# Altium schematic sheet DC-DC Converters.SchDoc: DC-DC Converters
size B; Organization: Drexel University; Address1: ECE Senior Design; Address2: 2018-2019; Address3: ECE-08; Revision: 1.0; SheetNumber: 7; SheetTotal: 9
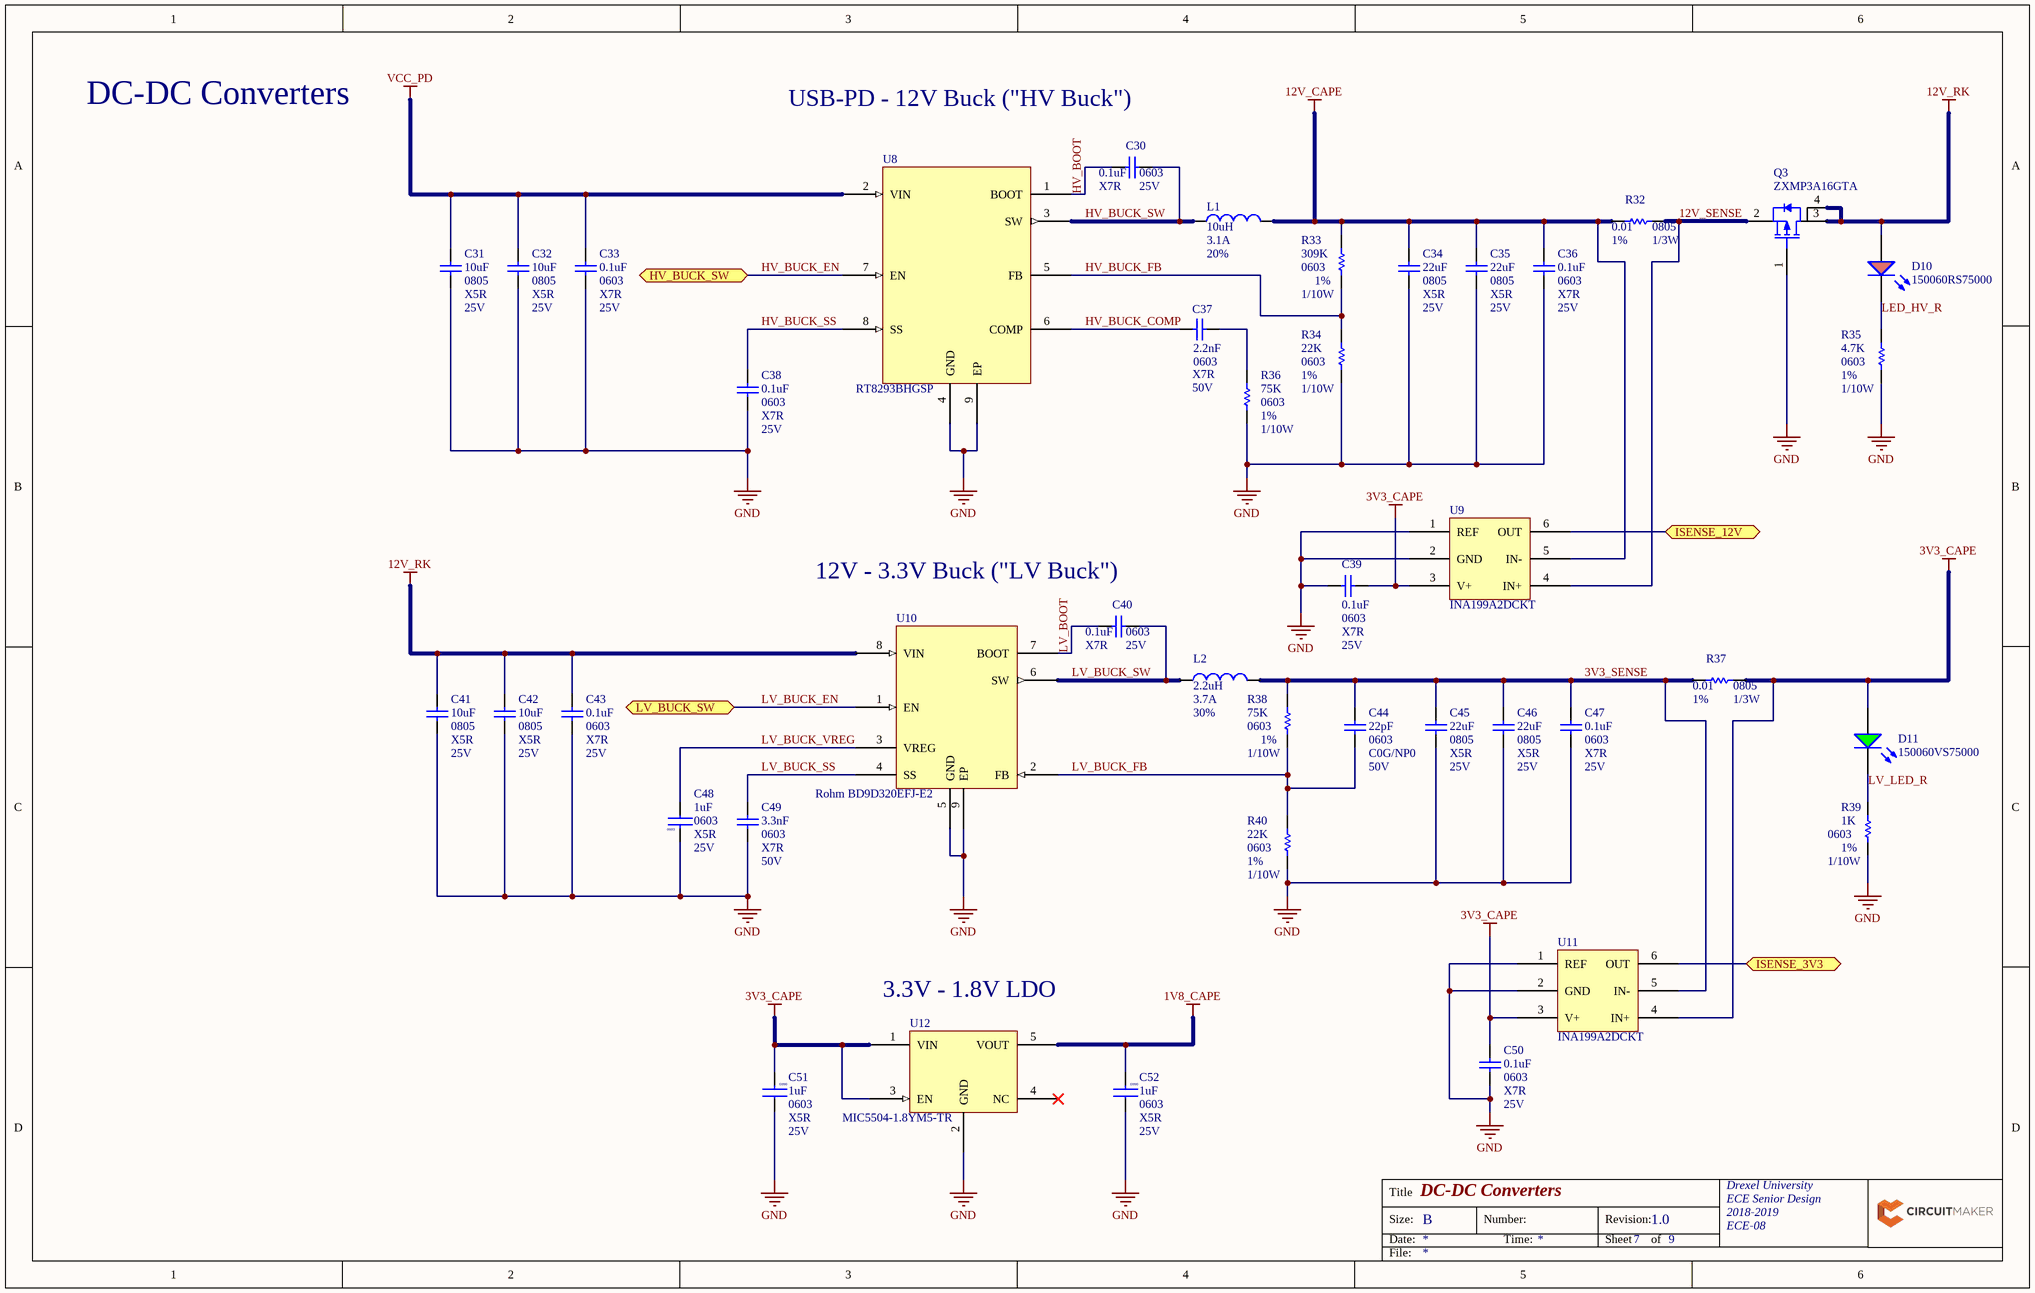
[diagram p0: DC-DC Converters.SchDoc]

## Parts
C30  Dielectric Characteristic: X7R  Voltage Rating (DC): 25V  Capacitance: 0.1uF  Package: 0603  [PCB-8usp83j76ntw2xroyu3n-1]  (hidden comment: Würth Elektronik 885012206071)
C31  Voltage Rating (DC): 25V  Package: 0805  Capacitance: 10uF  Temperature Coefficient: X5R  [Capacitor_0805]  (hidden comment: Murata GRM21BR61E106MA73L)
C32  Voltage Rating (DC): 25V  Package: 0805  Capacitance: 10uF  Temperature Coefficient: X5R  [Capacitor_0805]  (hidden comment: Murata GRM21BR61E106MA73L)
C33  Dielectric Characteristic: X7R  Voltage Rating (DC): 25V  Capacitance: 0.1uF  Package: 0603  [PCB-8usp83j76ntw2xroyu3n-1]  (hidden comment: Würth Elektronik 885012206071)
C34  Case/Package: 0805  Capacitance: 22uF  Temperature Coefficient: X5R  Voltage Rating: 25V  [PCB-sm9io2v4t6ucfy8bcald-1]  (hidden comment: CL21A226MAQNNNE)
C35  Case/Package: 0805  Capacitance: 22uF  Temperature Coefficient: X5R  Voltage Rating: 25V  [PCB-sm9io2v4t6ucfy8bcald-1]  (hidden comment: CL21A226MAQNNNE)
C36  Dielectric Characteristic: X7R  Voltage Rating (DC): 25V  Capacitance: 0.1uF  Package: 0603  [PCB-8usp83j76ntw2xroyu3n-1]  (hidden comment: Würth Elektronik 885012206071)
C37  Capacitance: 2.2nF  Pacakge: 0603  Temperature Coefficient: X7R  Voltage Rating: 50V  [PCB-rt9y6alohkqhfgbzbx9m-1]  (hidden comment: Cap)
C38  Dielectric Characteristic: X7R  Voltage Rating (DC): 25V  Capacitance: 0.1uF  Package: 0603  [PCB-8usp83j76ntw2xroyu3n-1]  (hidden comment: Würth Elektronik 885012206071)
C39  Dielectric Characteristic: X7R  Voltage Rating (DC): 25V  Capacitance: 0.1uF  Package: 0603  [PCB-8usp83j76ntw2xroyu3n-1]  (hidden comment: Würth Elektronik 885012206071)
C40  Dielectric Characteristic: X7R  Voltage Rating (DC): 25V  Capacitance: 0.1uF  Package: 0603  [PCB-8usp83j76ntw2xroyu3n-1]  (hidden comment: Würth Elektronik 885012206071)
C41  Voltage Rating (DC): 25V  Package: 0805  Capacitance: 10uF  Temperature Coefficient: X5R  [Capacitor_0805]  (hidden comment: Murata GRM21BR61E106MA73L)
C42  Voltage Rating (DC): 25V  Package: 0805  Capacitance: 10uF  Temperature Coefficient: X5R  [Capacitor_0805]  (hidden comment: Murata GRM21BR61E106MA73L)
C43  Dielectric Characteristic: X7R  Voltage Rating (DC): 25V  Capacitance: 0.1uF  Package: 0603  [PCB-8usp83j76ntw2xroyu3n-1]  (hidden comment: Würth Elektronik 885012206071)
C44  Capacitance: 22pF  Voltage Rating: 50V  Temperature Coefficient: C0G/NP0  Package: 0603  [PCB-c1bc5fz63nm5dhuj9x7i-1]  (hidden comment: Samsung CL10C220JB8NFNC)
C45  Case/Package: 0805  Capacitance: 22uF  Temperature Coefficient: X5R  Voltage Rating: 25V  [PCB-sm9io2v4t6ucfy8bcald-1]  (hidden comment: CL21A226MAQNNNE)
C46  Case/Package: 0805  Capacitance: 22uF  Temperature Coefficient: X5R  Voltage Rating: 25V  [PCB-sm9io2v4t6ucfy8bcald-1]  (hidden comment: CL21A226MAQNNNE)
C47  Dielectric Characteristic: X7R  Voltage Rating (DC): 25V  Capacitance: 0.1uF  Package: 0603  [PCB-8usp83j76ntw2xroyu3n-1]  (hidden comment: Würth Elektronik 885012206071)
C48  Case/Package: 0603  Dielectric Characteristic: X5R  Capacitance: 1uF  Voltage Rating (DC): 25V  [PCB-bncvufzharetcg4gy1u6-1]  (hidden comment: Taiyo Yuden TMK107BJ105KA-T)
C49  Capacitance: 3.3nF  Case/Package: 0603  Dielectric Characteristic: X7R  Voltage Rating (DC): 50V  [PCB-spmbmairbtzdei53y7wi-1]  (hidden comment: Würth Elektronik 885012206086)
C50  Dielectric Characteristic: X7R  Voltage Rating (DC): 25V  Capacitance: 0.1uF  Package: 0603  [PCB-8usp83j76ntw2xroyu3n-1]  (hidden comment: Würth Elektronik 885012206071)
C51  Case/Package: 0603  Dielectric Characteristic: X5R  Capacitance: 1uF  Voltage Rating (DC): 25V  [PCB-bncvufzharetcg4gy1u6-1]  (hidden comment: Taiyo Yuden TMK107BJ105KA-T)
C52  Case/Package: 0603  Dielectric Characteristic: X5R  Capacitance: 1uF  Voltage Rating (DC): 25V  [PCB-bncvufzharetcg4gy1u6-1]  (hidden comment: Taiyo Yuden TMK107BJ105KA-T)
D10  150060RS75000  [PCB-gaza7c7mdlgwi4y82xs2-1]
D11  150060VS75000  [0603_A]
L1  Inductance: 10uH  Current Rating: 3.1A  Tolerance: 20%  [Inductor]  (hidden comment: Inductor)
L2  Inductance: 2.2uH  Current Rating: 3.7A  Tolerance: 30%  [PCB-fuzgio0l72uhvfuauccx-1]  (hidden comment: Inductor)
Q3  Manufacturer Part Number: ZXMP3A16GTA  [SOT230P700X160-4N]  (hidden comment: SYM-6957a0575e87b690-1)
R32  Package: 0805  Power Rating: 1/3W  Resistance: 0.01  Tolerance: 1%  [PCB-5x7ab7seay4cz0nm4g1d-1]  (hidden comment: RU2012FR010CS)
R33  Case/Package: 0603  Power Rating: 1/10W  Resistance: 309K  Resistance Tolerance: 1%  [RESC1608X55X25LL10T15]  (hidden comment: Yageo RC0603FR-07309KL)
R34  Resistance: 22K  Resistance Tolerance: 1%  Case/Package: 0603  Power Rating: 1/10W  [RESC1608X55X25LL10T15]  (hidden comment: Yageo RC0603FR-0722KL)
R35  Resistance: 4.7K  Package: 0603  Power Rating: 1/10W  Tolerance: 1%  [CAPC1608X90X35NL15T15]  (hidden comment: 4k7)
R36  Case/Package: 0603  Resistance: 75K  Resistance Tolerance: 1%  Power: 1/10W  [BOUR-CR0603-FX-7502ELF_M]  (hidden comment: Bourns CR0603-FX-7502ELF)
R37  Package: 0805  Power Rating: 1/3W  Resistance: 0.01  Tolerance: 1%  [PCB-5x7ab7seay4cz0nm4g1d-1]  (hidden comment: RU2012FR010CS)
R38  Case/Package: 0603  Resistance: 75K  Resistance Tolerance: 1%  Power: 1/10W  [BOUR-CR0603-FX-7502ELF_M]  (hidden comment: Bourns CR0603-FX-7502ELF)
R39  Case/Package: 0603  Power Rating: 1/10W  Resistance: 1K  Resistance Tolerance: 1%  [PCB-rzdzs5ckhrcob8ss0hvn-1]  (hidden comment: Stackpole Electronics RMCF0603FT1K00)
R40  Resistance: 22K  Resistance Tolerance: 1%  Case/Package: 0603  Power Rating: 1/10W  [RESC1608X55X25LL10T15]  (hidden comment: Yageo RC0603FR-0722KL)
U8  RT8293BHGSP  [SOP127P600X175_HS-9N]
U9  INA199A2DCKT  [PCB-fk4u5s6fuzak3ls58m4h-1]
U10  Rohm BD9D320EFJ-E2  [TSOP127P600X100_HS-9N]
U11  INA199A2DCKT  [PCB-fk4u5s6fuzak3ls58m4h-1]
U12  MIC5504-1.8YM5-TR  [PCB-iw8x523xp2xa24mrz5ek-1]

## Ports
HV_BUCK_SW, ISENSE_3V3, ISENSE_12V, LV_BUCK_SW

## Nets
1V8_CAPE: C52.2 U12.5(VOUT)
3V3_CAPE: C39.2 C50.2 C51.2 D11.2(A) R37.2 U9.3(V+) U11.3(V+) U11.4(IN+) U12.1(VIN) U12.3(EN)
12V_CAPE: C34.1 C35.1 C36.2 L1.2 R32.1 R33.2 U9.5(IN-)
12V_RK: C41.2 C42.2 C43.2 D10.2(A) Q3.3(D) Q3.4 U10.8(VIN)
GND: C31.1 C32.1 C33.1 C34.2 C35.2 C36.1 C38.1 C39.1 C41.1 C42.1 C43.1 C45.2 C46.2 C47.1 C48.2 C49.1 C50.1 C51.1 C52.1 Q3.1(G) R34.1 R35.1 R36.1 R39.1 R40.1 U8.4(GND) U8.9(EP) U9.1(REF) U9.2(GND) U10.5(GND) U10.9(EP) U11.1(REF) U11.2(GND) U12.2(GND)
VCC_PD: C31.2 C32.2 C33.2 U8.2(VIN)
3V3_SENSE: C44.2 C45.1 C46.1 C47.2 L2.2 R37.1 R38.2 U11.5(IN-)
12V_SENSE: Q3.2(S) R32.2 U9.4(IN+)
HV_BOOT: C30.1 U8.1(BOOT)
HV_BUCK_COMP: C37.2 U8.6(COMP)
HV_BUCK_EN: U8.7(EN) ; port HV_BUCK_SW
HV_BUCK_FB: R33.1 R34.2 U8.5(FB)
HV_BUCK_SS: C38.2 U8.8(SS)
HV_BUCK_SW: C30.2 L1.1 U8.3(SW)
ISENSE_3V3: U11.6(OUT) ; port ISENSE_3V3
ISENSE_12V: U9.6(OUT) ; port ISENSE_12V
LED_HV_R: D10.1(K) R35.2
LV_BOOT: C40.1 U10.7(BOOT)
LV_BUCK_EN: U10.1(EN) ; port LV_BUCK_SW
LV_BUCK_FB: C44.1 R38.1 R40.2 U10.2(FB)
LV_BUCK_SS: C49.2 U10.4(SS)
LV_BUCK_SW: C40.2 L2.1 U10.6(SW)
LV_BUCK_VREG: C48.1 U10.3(VREG)
LV_LED_R: D11.1(K) R39.2
NetC37_1: C37.1 R36.2

Not connected (* = marked no-connect by the designer): U12 4(NC)*

## Notes on the sheet
- DC-DC Converters
- USB-PD - 12V Buck ("HV Buck")
- (near C40) 12V - 3.3V Buck ("LV Buck")
- (near U12) 3.3V - 1.8V LDO
- Title
- Size:
- Date:
- B
- Number:
- Time:
- Revision:
- Sheet
- of
- File:

## Library data of the parts
C30 C33 C36 C38-C40 C43 C47 C50 = CMP-034ac9768ab0dc8d-1: Multilayer Ceramic Capacitor, WCAP-CSGP Series, 0.1 F, 10%, X7R, 25 V, 0603 [1608 Metric]; RoHS: Compliant; Capacitance Tolerance: ±10%; OctopartID: 034ac9768ab0dc8d; Packaging: Cut Tape (CT); Octopart URL: http://octopart.com/885012206071-w%C3%BCrth+elektronik-53914780; Manufacturer Part Number: 885012206071
C31 C32 C41 C42 = CMP-3dadf66f6462e26a-3: 0805 25 V 10 uF ±20% Tolerance X5R Multilayer Ceramic Capacitor; Case/Package (SI): 2012; Size-Length: 2.00 mm; OctopartID: 3dadf66f6462e26a; RoHS: Compliant; Lifecycle Status: Active
C34 C35 C45 C46 = CMP-38b9f0cfc974e77e-4: Cap Multilayer Ceramic 0805 22uF 25V ±20% X5R CL21 Series; Lead-Free Status: Lead Free; Capacitance Tolerance: ±20%; Octopart URL: https://octopart.com/cl21a226maqnnne-samsung-24958123; Mounting Style: Surface Mount; Packaging: Tape & Reel (TR)
C37 = CMP-41698a7525199eae-1: Cap Ceramic 0.0022uF 50V X7R 10% SMD 0603 OMD-CAP with FlexiTerm 125C T/R; Octopart URL: https://octopart.com/cl10b222kb8wpnc-samsung-35012886
C44 = CMP-3812f064c92be7d5-1: Cap Ceramic 22pF 50V C0G 5% SMD 0603 125°C Paper T/R; Lead-Free Status: Lead Free; Octopart URL: https://octopart.com/cl10c220jb8nfnc-samsung-24958047; Manufacturer Part Number: CL10C220JB8NFNC; RoHS: Compliant; OctopartID: 3812f064c92be7d5
C48 C51 C52 = CMP-ac4e65478e587389-1: Cap Ceramic 1uF 25V X5R 10% SMD 0603 85°C Paper T/R; Lead-Free Status: Lead Free; Octopart URL: http://octopart.com/tmk107bj105ka-t-taiyo+yuden-198512; Packaging: Cut Tape (CT); Size-Width: 800 µm; Halogen Free Status: Halogen Free; Size-Length: 1.60 mm; Capacitance Tolerance: ±10%; OctopartID: ac4e65478e587389; Size-Height: 800 µm; Mounting Style: Surface Mount; Manufacturer Part Number: TMK107BJ105KA-T; Lifecycle Status: Active; Number of Pins: 2; RoHS: Compliant
C49 = CMP-e361295d6aac3ca6-1: Cap, Mlcc, X7r, 3300Pf, 50V, 0603; Capacitance Tolerance: ±10%; Octopart URL: https://octopart.com/885012206086-w%C3%BCrth+elektronik-53914795; Manufacturer Part Number: 885012206086; Mounting Style: Surface Mount; Operating Temperature: -55.0 °C (min); Packaging: Cut Tape (CT); RoHS: Compliant; OctopartID: e361295d6aac3ca6
D10 = CMP-12518859-4: Standard LEDs - SMD WL-SMCW SMDMono TpVw Waterclr 0603 Red; Luminous Intensity: 250 mcd; Viewing Angle: 140 °; Forward Voltage: 2.00 V; Case/Package: 0603; Manufacturer Part Number: 150060RS75000; Packaging: Cut Tape (CT); Octopart URL: https://octopart.com/150060rs75000-w%C3%BCrth+elektronik-29717776; Mounting Style: Surface Mount; REACH SVHC Compliance: No SVHC; OctopartID: 47368ff9174098f1; Color: Red
D11 = CMP-12518862-3: SMD mono-color Chip LED, WL-SMCW, Bright Green; Forward Voltage: 2.0 V; Luminous Intensity: 0.04 cd; Viewing Angle: 140 °; Octopart Url: https://octopart.com/150060vs75000-w%C3%BCrth+elektronik-29717778; OctopartID: 8ccb4404dcbf530c; REACH SVHC Compliance: No SVHC; RoHS: Compliant; Manufacturer Part Number: 150060VS75000
L1 = CMP-f52f3c4e3cb22ae8-2: Inductor Power Shielded Wirewound 10uH 20% 100KHz Ferrite 3.1A 44.2mOhm DCR 3131 T/R; Octopart URL: http://octopart.com/nr8040t100m-taiyo+yuden-7073019; OctopartID: f52f3c4e3cb22ae8
L2 = CMP-7545bccc63e2aa82-1: Inductor Power Shielded Wirewound 2.2uH 30% 100KHz Ferrite 3.7A 26mOhm DCR 2424 T/R; Manufacturer Part Number: NR6028T2R2N; Self Resonant Frequency: 68.0 MHz; Packaging: Cut Tape (CT); RoHS: Compliant; Number of Pins: 2; OctopartID: 7545bccc63e2aa82; Lifecycle Status: Active; Mounting Style: Surface Mount; Halogen Free Status: Halogen Free
Q3 = CMP-6957a0575e87b690-4: Trans MOSFET P-CH 30V 7.5A Automotive 4-Pin(3+Tab) SOT-223 T/R; Current Rating: -7.50 A; Rise Time: 3.82 ns; Drain to Source Voltage (Vds): 30.0 V; Power Dissipation: 2.00 W; Drain to Source Resistance (on) (Rds): 45.0 mΩ; Continuous Drain Current (Ids): 7.50 A; Voltage Rating (DC): -30.0 V; Lifecycle Status: Active; Octopart URL: https://octopart.com/zxmp3a16gta-diodes+inc.-660150; RoHS: Compliant; Case/Package: SOT-223; OctopartID: 6957a0575e87b690; Mounting Style: Surface Mount
R32 R37 = CMP-a19069208eb37e57-1: Resistor, 0805, 10mohm, 0.33w, 1/3w, 600ppm, 1%; OctopartID: a19069208eb37e57
R33 = CMP-1853482-2: RES SMD 309K OHM 1% 1/10W 0603; Lead-Free Status: Lead Free; Voltage Rating (DC): 50.0 V; Manufacturer Part Number: RC0603FR-07309KL; Mounting Style: Surface Mount; Octopart Url: https://octopart.com/rc0603fr-07309kl-yageo-1213852; OctopartID: a053694b00a97f94; RoHS: Compliant; Size-Height: 0.00045 m; Size-Length: 0.0016 m; Size-Width: 0.0008 m
R34 R40 = CMP-1853446-5: Chip Resistor, 22 KOhm, +/- 1%, 0.1 W, -55 to 155 degC, 0603 (1608 Metric), RoHS, Tape and Reel; Voltage Rating (DC): 50.0 V; Lead-Free Status: Lead Free; Case/Package (SI): 1608; Number of Pins: 2; Size-Height: 450 µm; PackageDescription: 2-Pin Surface Mount Device, Body 1.6 x 0.8 mm; Size-Width: 800 µm; Seller Landing  Url: https://octopart-clicks.com/click/track?country=US&ak=8157f166&sig=0952a08&sid=5489&ppid=40952860&vpid=270386233&ct=offers; DatasheetVersion: Rev. 4, 02/2016; PackageReference: 0603; Size-Length: 1.60 mm; RoHS: Compliant; Mounting Style: Surface Mount; OctopartID: 2162ea18e018fea5; Manufacturer Part Number: RC0603FR-0722KL; Packaging: Cut Tape (CT), Tape & Reel (TR); Octopart Url: http://octopart.com/rc0603fr-0722kl-yageo-40952860; REACH SVHC Compliance: No SVHC
R35 = CMP-3ca7f596181de360-9: Res Thick Film 0603 4.7K Ohm 1% 1/10W ±100ppm/°C Molded SMD SMD Paper Tape on Plastic Reel
R36 R38 = CMP-3652844-3: Thick Film Resistors - SMD 75K ohm 1%; Octopart Url: https://octopart.com/cr0603-fx-7502elf-bourns-3881290; OctopartID: 4de084d151cc9227; RoHS: Compliant; Size-Length: 0.0016002 m; Size-Thickness: 0.0004572 m; Size-Width: 0.0007874 m; Manufacturer Part Number: CR0603-FX-7502ELF
R39 = CMP-fdb3359cf2042274-2: RMCF Series 0603 0.1 W 1 kOhm ±1 % ±100 ppm/°C SMT Thick Film Chip Resistor; Lead-Free Status: Lead Free; Packaging: Tape & Reel (TR); Octopart URL: http://octopart.com/rmcf0603ft1k00-stackpole+electronics-19213009; Mounting Style: Surface Mount; OctopartID: fdb3359cf2042274; RoHS: Compliant; Manufacturer Part Number: RMCF0603FT1K00
U8 = CMP-92cc5aea56b44d0b-1: RT8293B Series 23 V 3 A 1.4 MHz Synchronous Step-Down Converter - SOIC-8EP; Lead-Free Status: Lead Free; Octopart URL: https://octopart.com/rt8293bhgsp-richtek-19718430; Manufacturer Part Number: RT8293BHGSP; Operating Temperature: -40.0 °C (min); Packaging: Cut Tape (CT); RoHS: Compliant; OctopartID: 92cc5aea56b44d0b
U9 U11 = CMP-a8b860a96634777f-1: 26-V, Bi-Directional, Zero-Drift, Low- or High-Side, Voltage Output Current Shunt Monitor 6-SC70 -40 to 125; Supply Current: 65.0 µA; Case/Package: SOT-363; Octopart URL: http://octopart.com/ina199a1dckr-texas+instruments-18607082; REACH SVHC Compliance: No SVHC; RoHS: Compliant; OctopartID: a8b860a96634777f; Number of Pins: 6
U10 = CMP-d72c1fff612d08eb-2: DC-DC Switching Buck Step Down Regulator, Adjustable, 4.5V-18Vin, 765mV-7Vout, 3Aout, HTSOP-8; Output Voltage: 7.00 V (max); Number of Outputs: 1; Octopart URL: https://octopart.com/bd9d320efj-e2-rohm-31036263
U12 = CMP-8e1b44eafdba51dc-1: Voltage regulator; LDO, fixed; 1.8V; 0.3A; SOT23-5; SMD; -40÷125°C; Output Current: 300 mA; Octopart URL: https://octopart.com/mic5504-1.8ym5-tr-microchip-66803399; Manufacturer Part Number: MIC5504-1.8YM5-TR; Case/Package: SOT-23; Lifecycle Status: Not Listed by Manufacturer; Mounting Style: Surface Mount; Operating Temperature: -40.0 °C (min); Packaging: Cut Tape (CT); RoHS: Compliant; OctopartID: 8e1b44eafdba51dc